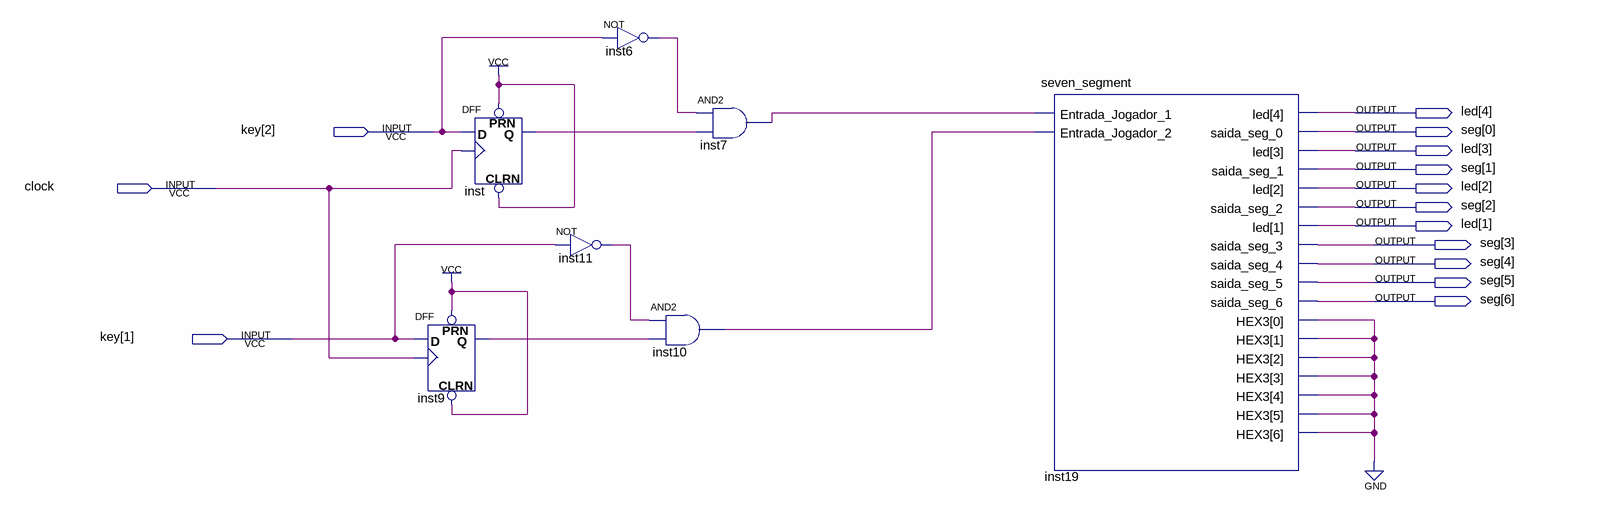
[diagram p0: schematic sheet]
// Quartus schematic reaction_game.bdf as structural Verilog: 7 symbols, 14 pins
module reaction_game (
  input  [2:1] key,
  input  clock,
  output [4:1] led,
  output [6:0] seg
);

  wire inst6_out, inst7_out, inst9_q, inst10_out, inst11_out, inst19_hex3, inst_q;

  DFF inst9 (.CLRN(1'b1), .CLK(clock), .D(key[1]), .PRN(1'b1), .Q(inst9_q));
  DFF inst (.CLRN(1'b1), .CLK(clock), .D(key[2]), .PRN(1'b1), .Q(inst_q));
  not inst11 (inst11_out, key[1]);
  not inst6 (inst6_out, key[2]);
  and inst10 (inst10_out, inst11_out, inst9_q);
  and inst7 (inst7_out, inst6_out, inst_q);
  seven_segment inst19 (
    .Entrada_Jogador_1(inst7_out), .Entrada_Jogador_2(inst10_out), .led(led), .saida_seg_0(seg[0]),
    .saida_seg_1(seg[1]), .saida_seg_2(seg[2]), .saida_seg_3(seg[3]), .saida_seg_4(seg[4]),
    .saida_seg_5(seg[5]), .saida_seg_6(seg[6]), .HEX3({7{inst19_hex3}}));
  // also tied to GND on the sheet: inst19_hex3
endmodule
